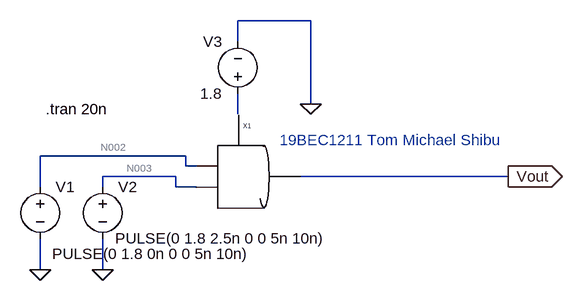
[diagram p0: schematic AND_TEST .asc]
AND_TEST .asc, the LTspice schematic file:
Version 4
SHEET 1 880 680
WIRE 256 -48 144 -48
WIRE 144 -16 144 -48
WIRE 256 80 256 -48
WIRE 144 96 144 64
WIRE 64 160 -160 160
WIRE 64 176 64 160
WIRE 80 176 64 176
WIRE 48 192 -64 192
WIRE 560 192 240 192
WIRE -160 208 -160 160
WIRE -64 208 -64 192
WIRE 48 208 48 192
WIRE 80 208 48 208
WIRE -160 336 -160 288
WIRE -64 336 -64 288
FLAG 256 80 0
FLAG -160 336 0
FLAG -64 336 0
FLAG 560 192 Vout
IOPIN 560 192 Out
SYMBOL voltage -160 192 R0
WINDOW 3 18 119 Left 2
SYMATTR Value PULSE(0 1.8 0n 0 0 5n 10n)
SYMATTR InstName V1
SYMBOL voltage -64 192 R0
WINDOW 3 19 95 Left 2
WINDOW 123 0 0 Left 0
WINDOW 39 0 0 Left 0
SYMATTR Value PULSE(0 1.8 2.5n 0 0 5n 10n)
SYMATTR InstName V2
SYMBOL voltage 144 80 R180
WINDOW 0 24 96 Left 2
WINDOW 3 24 16 Left 2
SYMATTR InstName V3
SYMATTR Value 1.8
SYMBOL AND_Sym 128 192 R0
SYMATTR InstName X1
TEXT -152 88 Left 2 !.tran 20n
TEXT 208 136 Left 2 ;19BEC1211 Tom Michael Shibu

The netlist it stands for:
* AND_TEST .asc
V1 N002 0 PULSE(0 1.8 0n 0 0 5n 10n)
V2 N003 0 PULSE(0 1.8 2.5n 0 0 5n 10n)
V3 N001 0 1.8
XX1 N002 N003 Vout N001 AND_Sym  ; pins Vin Vin2 Vout VDD
.tran 20n
* 19BEC1211 Tom Michael Shibu
.backanno
.end

* Results of the author's LTspice run, read from the files saved beside the schematic
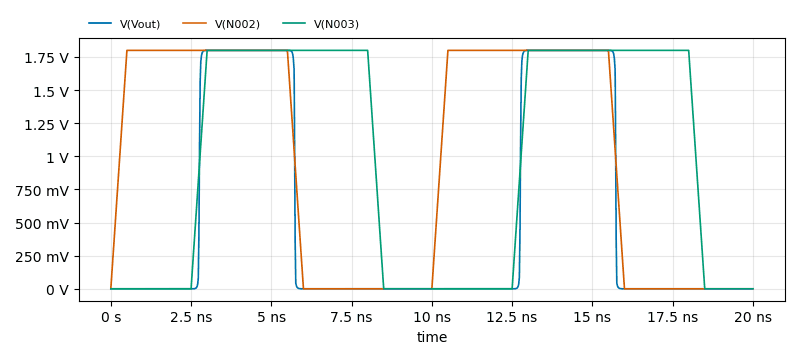
[diagram p1: Transient Analysis of AND_TEST .asc, plotted from the saved traces]
* Transient Analysis, 1 run:
*   V(Vout): min 0 V, max 1.8 V, average 534.4 mV, rms 976.8 mV, last 0 V
*   V(N002): min 0 V, max 1.8 V, average 989.9 mV, rms 1.325 V, last 0 V
*   V(N003): min 0 V, max 1.8 V, average 990 mV, rms 1.321 V, last 0 V